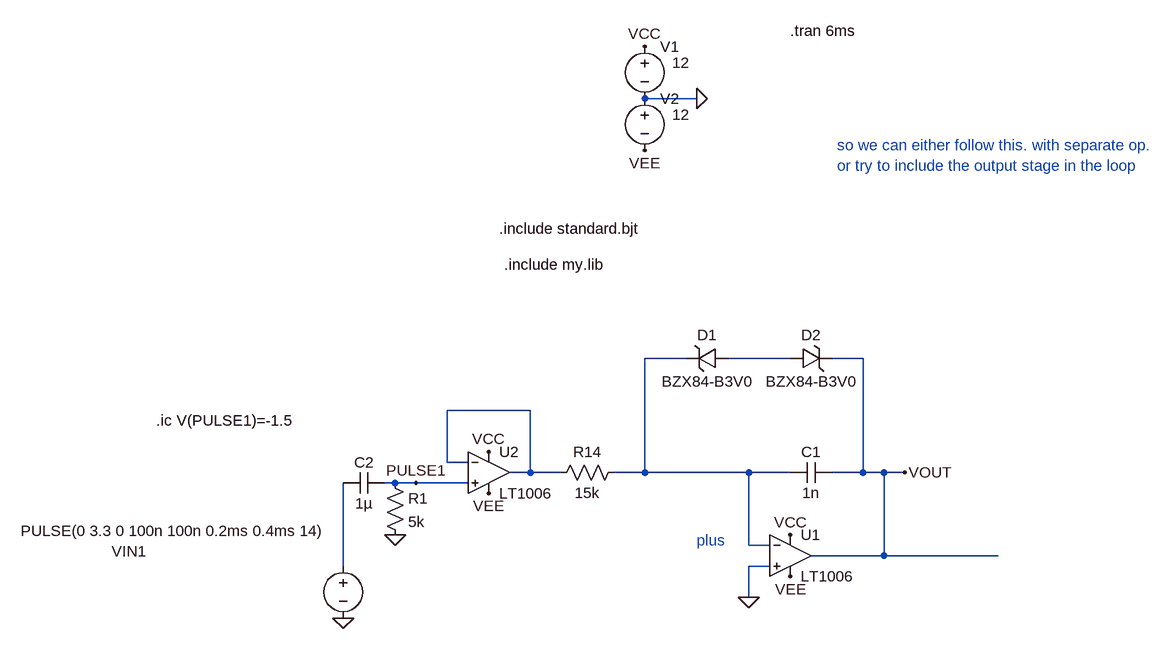
[diagram p0: schematic Draft101.asc]
Draft101.asc, the LTspice schematic file:
Version 4
SHEET 1 3300 1956
WIRE 544 -288 464 -288
WIRE 528 112 464 112
WIRE 688 112 592 112
WIRE 800 112 752 112
WIRE 288 192 160 192
WIRE 160 272 160 192
WIRE 192 272 160 272
WIRE 288 288 288 192
WIRE 288 288 256 288
WIRE 336 288 288 288
WIRE 464 288 464 112
WIRE 464 288 416 288
WIRE 624 288 464 288
WIRE 688 288 624 288
WIRE 800 288 800 112
WIRE 800 288 752 288
WIRE 832 288 800 288
WIRE 864 288 832 288
WIRE 80 304 64 304
WIRE 112 304 80 304
WIRE 192 304 112 304
WIRE 624 400 624 288
WIRE 656 400 624 400
WIRE 832 416 832 288
WIRE 832 416 720 416
WIRE 1008 416 832 416
WIRE 0 432 0 304
WIRE 656 432 624 432
WIRE 624 480 624 432
FLAG 464 -368 VCC
FLAG 0 512 0
FLAG 544 -288 0
FLAG 624 480 0
FLAG 688 384 VCC
FLAG 864 288 VOUT
FLAG 464 -208 VEE
FLAG 688 448 VEE
FLAG 224 256 VCC
FLAG 224 320 VEE
FLAG 80 384 0
FLAG 112 304 PULSE1
SYMBOL voltage 464 -384 R0
WINDOW 123 0 0 Left 0
WINDOW 39 0 0 Left 0
WINDOW 3 42 41 Left 2
SYMATTR Value 12
SYMATTR InstName V1
SYMBOL voltage 0 416 R0
WINDOW 123 0 0 Left 0
WINDOW 39 0 0 Left 0
WINDOW 3 -496 -38 Left 2
WINDOW 0 -356 -7 Left 2
SYMATTR Value PULSE(0 3.3 0 100n 100n 0.2ms 0.4ms 14)
SYMATTR InstName VIN1
SYMBOL res 320 304 R270
WINDOW 0 32 56 VTop 2
WINDOW 3 0 56 VBottom 2
SYMATTR InstName R14
SYMATTR Value 15k
SYMBOL cap 752 272 R90
WINDOW 0 0 32 VBottom 2
WINDOW 3 32 32 VTop 2
SYMATTR InstName C1
SYMATTR Value 1n
SYMBOL OpAmps\\LT1006 688 352 R0
SYMATTR InstName U1
SYMBOL voltage 464 -304 R0
WINDOW 123 0 0 Left 0
WINDOW 39 0 0 Left 0
WINDOW 3 42 41 Left 2
SYMATTR Value 12
SYMATTR InstName V2
SYMBOL zener 592 96 R90
WINDOW 0 -4 32 VBottom 2
WINDOW 3 36 32 VTop 2
SYMATTR InstName D1
SYMATTR Value BZX84-B3V0
SYMATTR Description Diode
SYMATTR Type diode
SYMBOL zener 688 128 R270
WINDOW 0 36 32 VTop 2
WINDOW 3 -4 32 VBottom 2
SYMATTR InstName D2
SYMATTR Value BZX84-B3V0
SYMATTR Description Diode
SYMATTR Type diode
SYMBOL OpAmps\\LT1006 224 224 R0
SYMATTR InstName U2
SYMBOL cap 64 288 R90
WINDOW 0 0 32 VBottom 2
WINDOW 3 32 32 VTop 2
SYMATTR InstName C2
SYMATTR Value 1µ
SYMBOL res 64 288 R0
SYMATTR InstName R1
SYMATTR Value 5k
TEXT 688 -392 Left 2 !.tran 6ms
TEXT 544 392 Left 2 ;plus
TEXT 240 -88 Left 2 !.include standard.bjt
TEXT 760 -216 Left 2 ;so we can either follow this. with separate op.\nor try to include the output stage in the loop
TEXT 248 -32 Left 2 !.include my.lib
TEXT -288 208 Left 2 !.ic V(PULSE1)=-1.5

The netlist it stands for:
* Draft101.asc
V1 VCC 0 12
VIN1 N004 0 PULSE(0 3.3 0 100n 100n 0.2ms 0.4ms 14)
R14 N003 N001 15k
C1 VOUT N001 1n
XU1 0 N001 VCC VEE VOUT LT1006  ; pins In+ In- V+ V- OUT
V2 0 VEE 12
D1 N002 N001 BZX84-B3V0
D2 N002 VOUT BZX84-B3V0
XU2 PULSE1 N003 VCC VEE N003 LT1006  ; pins In+ In- V+ V- OUT
C2 PULSE1 N004 1µ
R1 PULSE1 0 5k
.model D D
.lib standard.dio
.tran 6ms
* plus
.include standard.bjt
* so we can either follow this. with separate op.
* or try to include the output stage in the loop
.include my.lib
.ic V(PULSE1)=-1.5
.lib LTC.lib
.backanno
.end